# EAGLE design 01 (EAGLE 6.5.0)
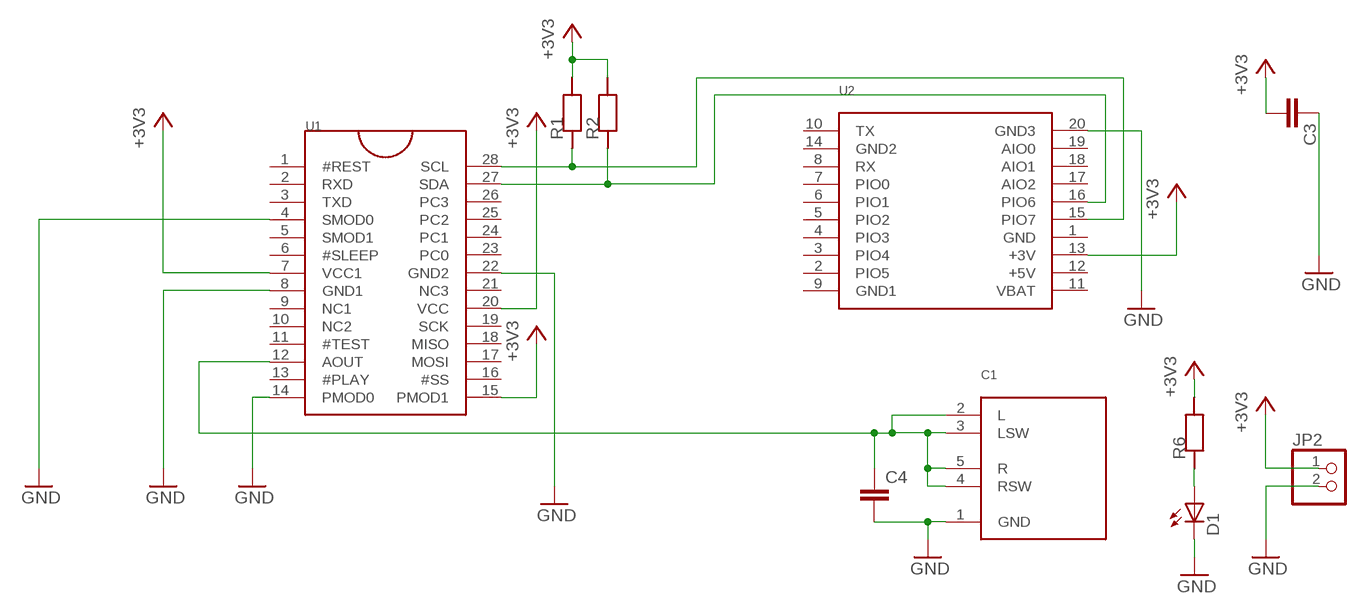
[diagram p0: schematic, sheet 1]

## Parts
C1  C-02384_AJ-1780  [AJ-1780]
C3  C_1068  [C0603]
C4  C_1068  [C0603]
D1  LEDCHIPLED_0805  [CHIPLED_0805]
JP2  PINHD-1X2/90  [1X02/90]
R1  R_1068  [R0603]
R2  R_1068  [R0603]
R6  R_1068  [R0603]
U1  I-06220_ATP3011F1-PU  [DIL28-3]
U2  KONASHI  [KONASHI]

## Nets
+3V3: C3.2 JP2.1 R1.2 R2.2 R6.2 U1.7(VCC1) U1.15(PMOD1) U1.20(VCC) U2.13(+3V)
GND [GND]: C1.1(GND) C3.1 C4.2 D1.C JP2.2 U1.4(SMOD0) U1.8(GND1) U1.14(PMOD0) U1.22(GND2) U2.20(GND3)
N$2: C1.2(L) C1.3(LSW) C1.4(RSW) C1.5(R) C4.1 U1.12(AOUT)
N$5 [GND]: R2.1 U1.27(SDA) U2.16(PIO6)
N$8 [GND]: R1.1 U1.28(SCL) U2.15(PIO7)
N$35: D1.A R6.1
Unconnected: U1.1(#REST) U1.2(RXD) U1.3(TXD) U1.5(SMOD1) U1.6(#SLEEP) U1.9(NC1) U1.10(NC2) U1.11(#TEST) U1.13(#PLAY) U1.16(#SS) U1.17(MOSI) U1.18(MISO) U1.19(SCK) U1.21(NC3) U1.23(PC0) U1.24(PC1) U1.25(PC2) U1.26(PC3) U2.1(GND) U2.2(PIO5) U2.3(PIO4) U2.4(PIO3) U2.5(PIO2) U2.6(PIO1) U2.7(PIO0) U2.8(RX) U2.9(GND1) U2.10(TX) U2.11(VBAT) U2.12(+5V) U2.14(GND2) U2.17(AIO2) U2.18(AIO1) U2.19(AIO0)

## Library data of the parts
C1 = Akizuki:C-02384_AJ-1780
C3 C4 = MyPacklbr:C_1068
D1 = led:LED: LED OSRAM: - CHIPLED LG R971, LG N971, LY N971, LG Q971, LY Q971, LO R971, LY R971 LH N974, LH R974 LS Q976, LO Q976, LY Q976 LO Q996 - Hyper CHIPLED LW Q18S LB Q993, LB Q99A, LB R99A - SideLED LS A670, LO A670, LY A670, LG A670, LP A670 LB A673, LV A673, LT A673, LW A673 LH A674 LY A675 LS A676, LA A676, LO A676, LY A676, LW A676 LS A679, LY A679, LG A679 - Hyper Micro SIDELED® LS Y876, LA Y876, LO Y876, LY Y876 LT Y87S - SmartLED LW L88C, LW L88S LB L89C, LB L89S, LG L890 LS L89K, LO L89K, LY L89K LS L896, LA L896, LO L896, LY L896 - TOPLED LS T670, LO T670, LY T670, LG T670, LP T670 LSG T670, LSP T670, LSY T670, LOP T670, LYG T670 LG T671, LOG T671, LSG T671 LB T673, LV T673, LT T673, LW T673 LH T674 LS T676, LA T676, LO T676, LY T676, LB T676, LH T676, LSB T676, LW T676 LB T67C, LV T67C, LT T67C, LS T67K, LO T67K, LY T67K, LW E67C LS E67B, LA E67B, LO E67B, LY E67B, LB E67C, LV E67C, LT E67C LW T67C LS T679, LY T679, LG T679 LS T770, LO T770, LY T770, LG T770, LP T770 LB T773, LV T773, LT T773, LW T773 LH T774 LS E675, LA E675, LY E675, LS T675 LS T776, LA T776, LO T776, LY T776, LB T776 LHGB T686 LT T68C, LB T68C - Hyper Mini TOPLED® LB M676 - Mini TOPLED Santana® LG M470 LS M47K, LO M47K, LY M47K Source: http://www.osram.convergy.de LUXEON: - LUMILED® LXK2-PW12-R00, LXK2-PW12-S00, LXK2-PW14-U00, LXK2-PW14-V00 LXK2-PM12-R00, LXK2-PM12-S00, LXK2-PM14-U00 LXK2-PE12-Q00, LXK2-PE12-R00, LXK2-PE12-S00, LXK2-PE14-T00, LXK2-PE14-U00 LXK2-PB12-K00, LXK2-PB12-L00, LXK2-PB12-M00, LXK2-PB14-N00, LXK2-PB14-P00, LXK2-PB14-Q00 LXK2-PR12-L00, LXK2-PR12-M00, LXK2-PR14-Q00, LXK2-PR14-R00 LXK2-PD12-Q00, LXK2-PD12-R00, LXK2-PD12-S00 LXK2-PH12-R00, LXK2-PH12-S00 LXK2-PL12-P00, LXK2-PL12-Q00, LXK2-PL12-R00 Source: www.luxeon.com KINGBRIGHT: KA-3528ASYC Source: www.kingbright.com
JP2 = pinhead:PINHD-1X2: PIN HEADER
R1 R2 R6 = MyPacklbr:R_1068
U1 = Akizuki:I-06220_ATP3011F1-PU
U2 = BLE:KONASHI

## Net classes
1 GND: width 0.1 mm, drill 0.2 mm

## Board
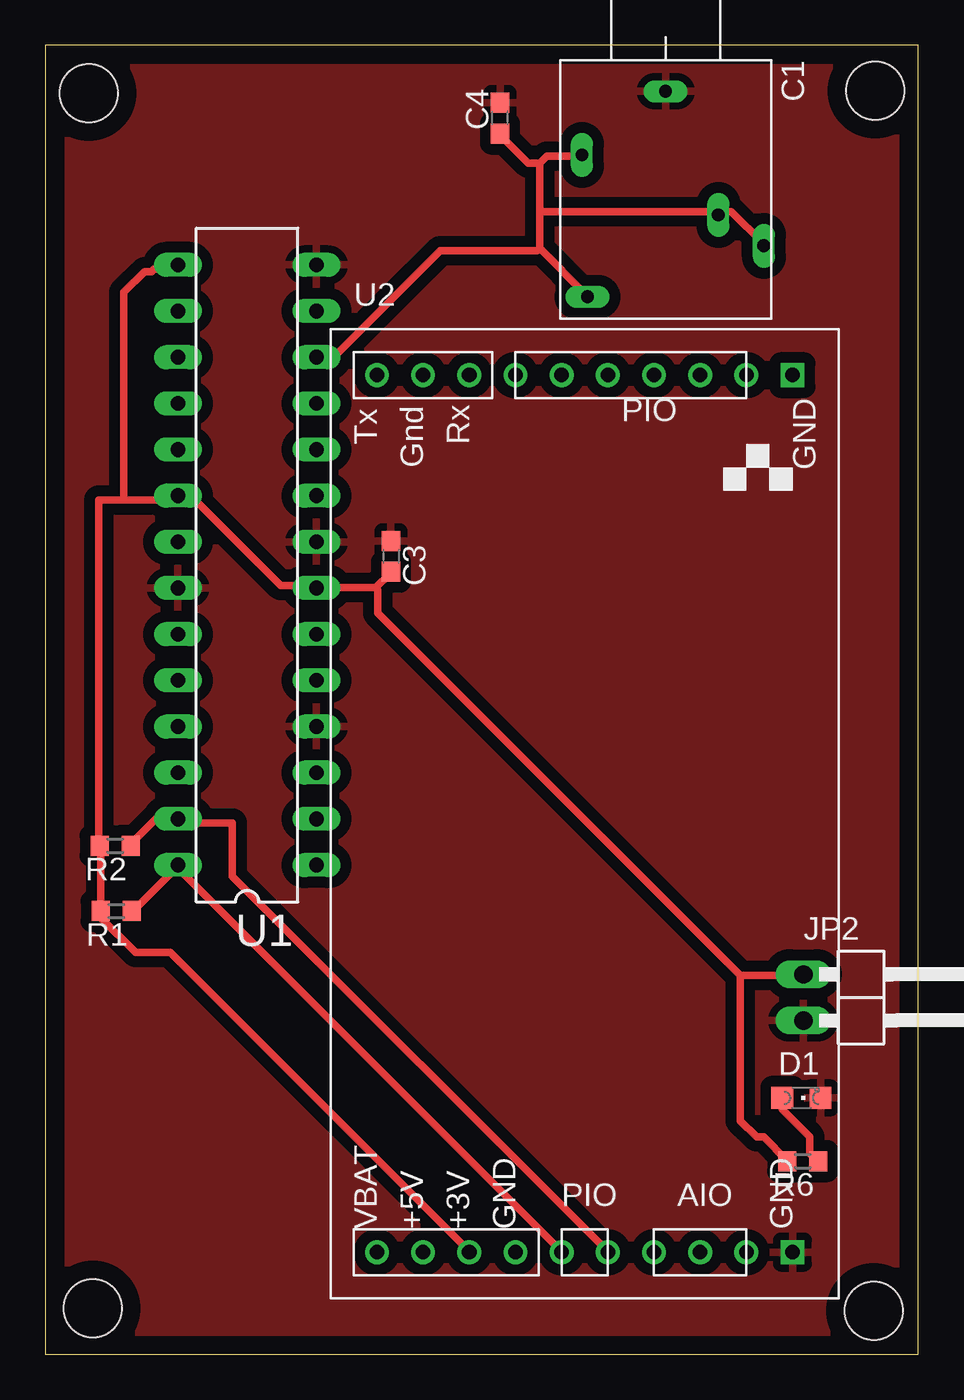
[diagram p1: board, top side]

Size 48 x 72 mm. Coordinates in mm from the lower left corner, seen from the top.
Outline: 0,0 48,0 48,72 0,72 0,0
Copper layers (1*16): Top 0.035mm / dielectric 1.5mm / Bottom 0.035mm
Design rules "default *": minimum track width 16mil, minimum drill 24mil, track to track 24mil, track to pad 16mil, pad to pad 8mil, via to via 8mil, smd to smd 8mil, copper to edge 40mil, drill to drill 8mil, minimum pad ring 10mil, minimum via ring 8mil, stop-mask expansion 4mil, vias tented up to drill 0mil, thermal gap 16mil
Holes 3.2 mm at 2.37,69.38 45.64,69.51 45.57,2.37 2.59,2.52

### Footprints (pad centres in the part's own frame; a part is rotated, then mirrored left to right if it is on the bottom)
AJ-1780 = drill 0.7 long: 1 1.7,0; 2 10.2,5.4; 3 8.5,2.9; 4 13,-4.3; 5 5.2,-4.6
C0603 = smd 1.1 x 1: 1 -0.85,0; 2 0.85,0
CHIPLED_0805 = smd 1.2 x 1.2: A 0,-1.05; C 0,1.05
1X02/90 = drill 1.016 long: 1 -1.27,-3.81; 2 1.27,-3.81
R0603 = smd 1 x 1.1: 1 -0.85,0; 2 0.85,0
DIL28-3 = drill 0.813 long: 1 -16.51,-3.81; 2 -13.97,-3.81; 3 -11.43,-3.81; 4 -8.89,-3.81; 5 -6.35,-3.81; 6 -3.81,-3.81; 7 -1.27,-3.81; 8 1.27,-3.81; 9 3.81,-3.81; 10 6.35,-3.81; 11 8.89,-3.81; 12 11.43,-3.81; 13 13.97,-3.81; 14 16.51,-3.81; 15 16.51,3.81; 16 13.97,3.81; 17 11.43,3.81; 18 8.89,3.81; 19 6.35,3.81; 20 3.81,3.81; 21 1.27,3.81; 22 -1.27,3.81; 23 -3.81,3.81; 24 -6.35,3.81; 25 -8.89,3.81; 26 -11.43,3.81; 27 -13.97,3.81; 28 -16.51,3.81
KONASHI = drill 0.8: 1 0,48.26; 2 2.54,48.26; 3 5.08,48.26; 4 7.62,48.26; 5 10.16,48.26; 6 12.7,48.26; 7 15.24,48.26; 8 17.78,48.26; 9 20.32,48.26; 11 0,0; 12 2.54,0; 13 5.08,0; 14 7.62,0; 15 10.16,0; 16 12.7,0; 17 15.24,0; 18 17.78,0; 19 20.32,0 | drill 0.8 square: 10 22.86,48.26; 20 22.86,0

### Placement (x,y rotation side)
C1  34.11,71.18 270 top
C3  19,43.89 270 top
C4  25,68 90 top
D1  41.58,14.09 270 top
JP2  45.49,19.62 270 top
R1  3.89,24.37 180 top
R2  3.84,27.97 180 top
R6  41.65,10.61 180 top
U1  11.09,43.42 90 top
U2  18.23,5.6 0 top

### Tracks (layer width: path | path; a pad name or v marks a point on that pad's centre or on a via)
+3V3
  Top 0.406: 38.23,20.83 38.23,12.83 39.12,11.94 39.5,11.94 40.77,10.67 R6.2 | 38.23,20.83 41.66,20.83 JP2.1 | 18.16,42.16 18.92,42.93 C3.2 | 18.16,42.16 14.99,42.16 U1.7 14.73,42.16 14.61,42.29 12.95,42.29 8,47.24 7.49,47.24 U1.20 7.24,47.12 6.48,47.12 6.35,46.99 4.32,46.99 | 4.32,46.99 2.92,46.99 2.92,28.07 R2.2 3.05,27.94 3.05,24.38 R1.2 3.05,24.26 3.05,24 4.95,22.1 6.86,22.1 23.24,5.71 U2.13 | 4.32,46.99 4.32,58.42 5.46,59.56 5.84,59.56 5.97,59.69 7.11,59.69 7.24,59.82 U1.15 | 38.23,20.83 18.29,40.77 18.29,42.04 18.16,42.16
GND
  pour Top: 47.5,71 47,1 1,1 1,71
N$2
  Top 0.406: C1.2 39.5,61.09 37.72,62.87 37.08,62.87 36.96,62.74 C1.3 36.83,62.87 27.18,62.87 | 27.18,65.53 26.54,65.53 25.02,67.06 C4.1 | 27.18,65.53 27.56,65.91 29.46,65.91 C1.5 | 27.18,60.83 29.72,58.29 C1.4 | 27.18,65.53 27.18,62.87 | 27.18,62.87 27.18,60.83 | U1.12 14.99,54.86 15.11,54.99 16,54.99 21.72,60.71 27.05,60.71 27.18,60.83
N$5
  Top 0.406: R2.1 4.7,28.07 6.1,29.46 7.24,29.46 U1.27 7.49,29.46 8,29.46 8.26,29.21 10.29,29.21 10.29,26.29 30.86,5.71 U2.16
N$8
  Top 0.406: R1.1 4.83,24.38 7.24,26.8 U1.28 7.37,26.67 28.32,5.71 U2.15
N$35
  Top 0.406: R6.1 42.42,10.67 42.04,11.05 42.04,11.94 40.51,13.46 40.51,13.97 D1.A